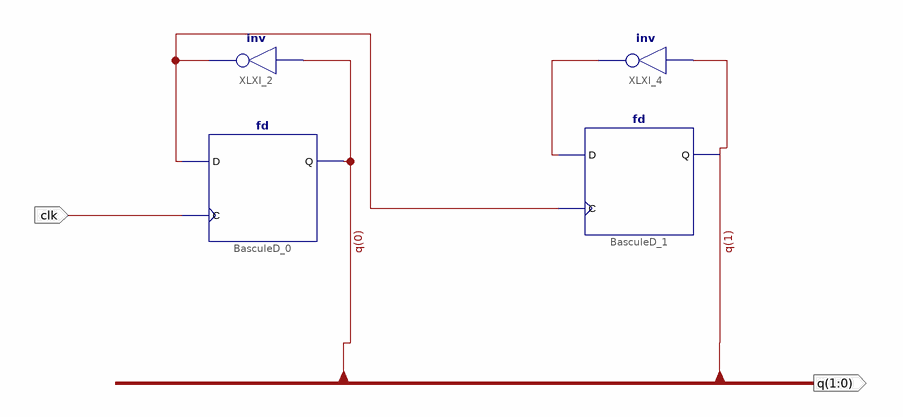
[diagram p0: schematic sheet 1]
// Xilinx ISE schematic compteur4.sch (spartan3e) as structural Verilog: 4 symbols, 2 ports
module compteur4 (
  input  clk,
  output [1:0] q
);

  wire XLXN_4, XLXN_17;

  fd BasculeD_0 (.C(clk), .D(XLXN_4), .Q(q[0]));
  not XLXI_2 (XLXN_4, q[0]);
  fd BasculeD_1 (.C(XLXN_4), .D(XLXN_17), .Q(q[1]));
  not XLXI_4 (XLXN_17, q[1]);
endmodule
